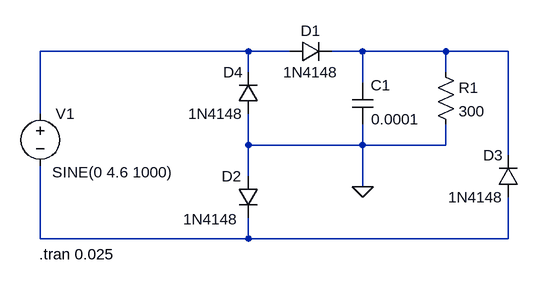
[diagram p0: schematic project1.asc]
project1.asc, the LTspice schematic file:
Version 4
SHEET 1 880 680
WIRE 256 -64 -64 -64
WIRE 320 -64 256 -64
WIRE 432 -64 384 -64
WIRE 560 -64 432 -64
WIRE 656 -64 560 -64
WIRE 256 -32 256 -64
WIRE 560 -32 560 -64
WIRE 432 -16 432 -64
WIRE -64 32 -64 -64
WIRE 256 80 256 32
WIRE 432 80 432 48
WIRE 432 80 256 80
WIRE 560 80 560 48
WIRE 560 80 432 80
WIRE 656 96 656 -64
WIRE 256 128 256 80
WIRE 432 144 432 80
WIRE -64 224 -64 112
WIRE 256 224 256 192
WIRE 256 224 -64 224
WIRE 656 224 656 160
WIRE 656 224 256 224
FLAG 432 144 0
SYMBOL voltage -64 16 R0
WINDOW 3 18 106 Left 2
SYMATTR InstName V1
SYMATTR Value SINE(0 4.6 1000)
SYMBOL diode 320 -48 R270
WINDOW 0 32 32 VTop 2
WINDOW 3 0 32 VBottom 2
SYMATTR InstName D1
SYMATTR Value 1N4148
SYMBOL diode 240 128 R0
WINDOW 0 -25 0 Left 2
WINDOW 3 -84 66 Left 2
SYMATTR InstName D2
SYMATTR Value 1N4148
SYMBOL diode 672 160 R180
WINDOW 0 24 64 Left 2
WINDOW 3 24 0 Left 2
SYMATTR InstName D3
SYMATTR Value 1N4148
SYMBOL diode 272 32 R180
WINDOW 0 24 64 Left 2
WINDOW 3 24 0 Left 2
SYMATTR InstName D4
SYMATTR Value 1N4148
SYMBOL res 544 -48 R0
SYMATTR InstName R1
SYMATTR Value 300
SYMBOL cap 416 -16 R0
WINDOW 0 28 4 Left 2
WINDOW 3 29 56 Left 2
SYMATTR InstName C1
SYMATTR Value 0.0001
TEXT -66 248 Left 2 !.tran 0.025

The netlist it stands for:
* project1.asc
V1 N001 N003 SINE(0 4.6 1000)
D1 N001 N002 1N4148
D2 0 N003 1N4148
D3 N003 N002 1N4148
D4 0 N001 1N4148
R1 N002 0 300
C1 N002 0 0.0001
.model D D
.lib standard.dio
.tran 0.025
.backanno
.end